# Altium schematic sheet Status_LEDs.SchDoc
size B; SheetNumber: 10; SheetTotal: 12
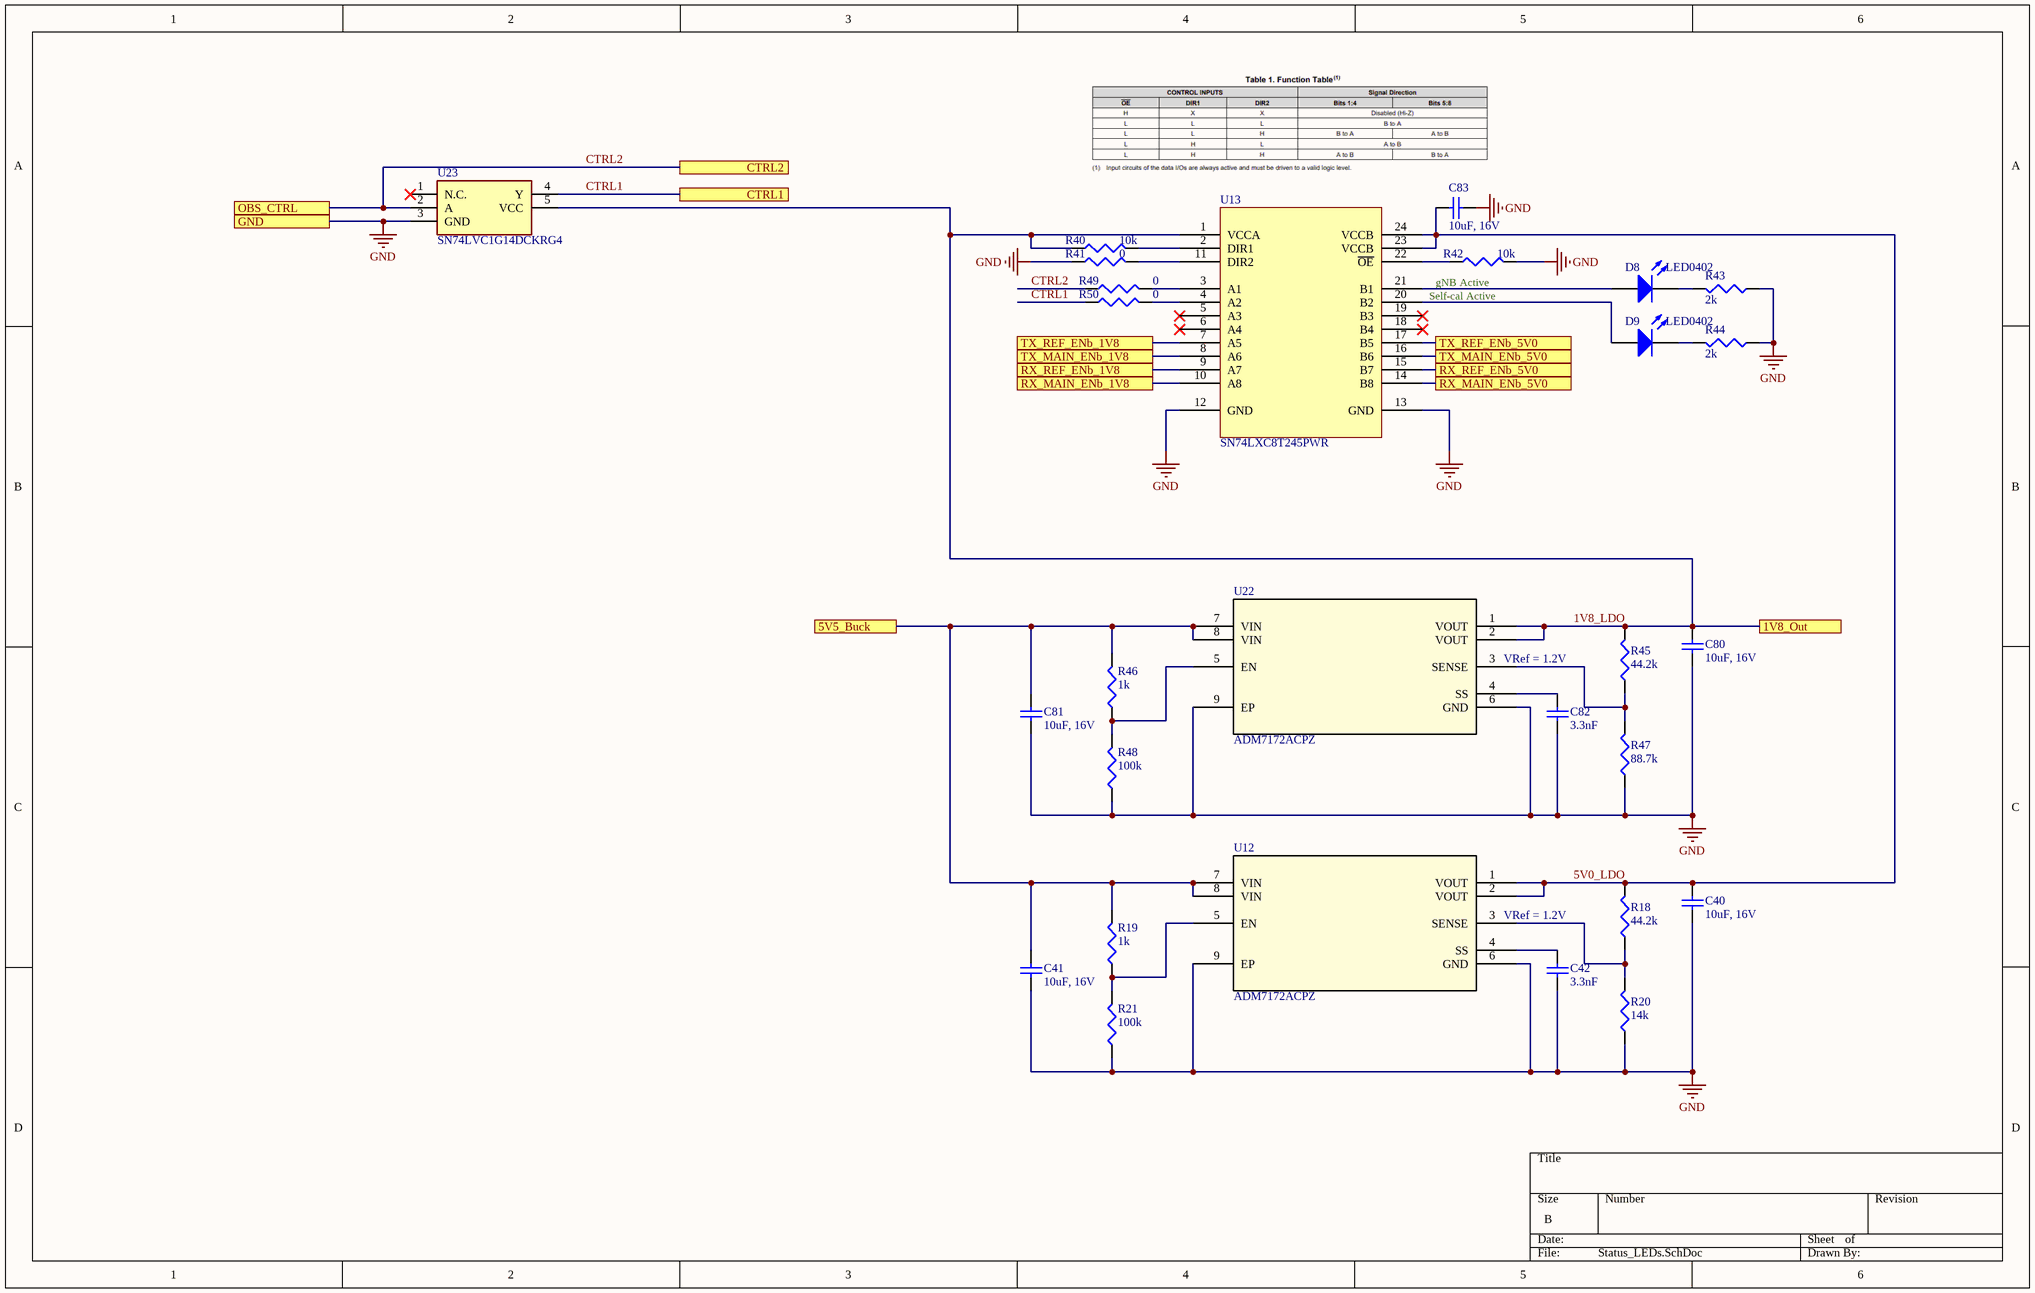
[diagram p0: Status_LEDs.SchDoc]

## Parts
C40  10uF, 16V  [SMD-0603]
C41  10uF, 16V  [SMD-0603]
C42  3.3nF  [Johanson-0201]
C80  10uF, 16V  [SMD-0603]
C81  10uF, 16V  [SMD-0603]
C82  3.3nF  [Johanson-0201]
C83  10uF, 16V  [SMD-0603]
D8  LED0402  [LED-0402]
D9  LED0402  [LED-0402]
R18  44.2k  [SMD-0402]
R19  1k  [SMD-0402]
R20  14k  [SMD-0402]
R21  100k  [SMD-0402]
R40  10k  [SMD-0402]
R41  0  [SMD-0402]
R42  10k  [SMD-0402]
R43  2k  [SMD-0402]
R44  2k  [SMD-0402]
R45  44.2k  [SMD-0402]
R46  1k  [SMD-0402]
R47  88.7k  [SMD-0402]
R48  100k  [SMD-0402]
R49  0  [SMD-0402]
R50  0  [SMD-0402]
U12  ADM7172ACPZ  [ADM7172_VIA_NOSILK]
U13  SN74LXC8T245PWR  [SN74AXC8T245PWR]
U22  ADM7172ACPZ  [ADM7172_VIA_NOSILK]
U23  SN74LVC1G14DCKRG4  [SN74LVC1G14DCKRG4]

## Ports
1V8_Out, 5V5_Buck, CTRL1, CTRL2, GND, OBS_CTRL, RX_MAIN_ENb_1V8, RX_MAIN_ENb_5V0, RX_REF_ENb_1V8, RX_REF_ENb_5V0, TX_MAIN_ENb_1V8, TX_MAIN_ENb_5V0, TX_REF_ENb_1V8, TX_REF_ENb_5V0

## Nets
GND: C40.1 C41.1 C42.1 C80.1 C81.1 C82.1 C83.1 R20.1 R21.1 R41.1 R42.2 R43.1 R44.1 R47.1 R48.1 U12.6(GND) U12.9(EP) U13.12(GND) U13.13(GND) U22.6(GND) U22.9(EP) U23.3(GND) ; port GND
1V8_LDO: C80.2 R40.1 R45.2 U13.1(VCCA) U22.1(VOUT) U22.2(VOUT) U23.5(VCC) ; port 1V8_Out
5V0_LDO: C40.2 C83.2 R18.2 U12.1(VOUT) U12.2(VOUT) U13.23(VCCB) U13.24(VCCB)
5V5_Buck: C41.2 C81.2 R19.2 R46.2 U12.7(VIN) U12.8(VIN) U22.7(VIN) U22.8(VIN) ; port 5V5_Buck
CTRL1: R50.1 U23.4(Y) ; port CTRL1
CTRL2: R49.1 U23.2(A) ; port OBS_CTRL, port CTRL2
RX_MAIN_ENb_1V8: U13.10(A8) ; port RX_MAIN_ENb_1V8
RX_MAIN_ENb_5V0: U13.14(B8) ; port RX_MAIN_ENb_5V0
RX_REF_ENb_1V8: U13.9(A7) ; port RX_REF_ENb_1V8
RX_REF_ENb_5V0: U13.15(B7) ; port RX_REF_ENb_5V0
TX_MAIN_ENb_1V8: U13.8(A6) ; port TX_MAIN_ENb_1V8
TX_MAIN_ENb_5V0: U13.16(B6) ; port TX_MAIN_ENb_5V0
TX_REF_ENb_1V8: U13.7(A5) ; port TX_REF_ENb_1V8
TX_REF_ENb_5V0: U13.17(B5) ; port TX_REF_ENb_5V0
NetC42_2: C42.2 U12.4(SS)
NetC82_2: C82.2 U22.4(SS)
NetD8_1: D8.1(K) R43.2
NetD8_2: D8.2(A) U13.21(B1)
NetD9_1: D9.1(K) R44.2
NetD9_2: D9.2(A) U13.20(B2)
NetR18_1: R18.1 R20.2 U12.3(SENSE)
NetR19_1: R19.1 R21.2 U12.5(EN)
NetR40_2: R40.2 U13.2(DIR1)
NetR41_2: R41.2 U13.11(DIR2)
NetR42_1: R42.1 U13.22(~{OE})
NetR45_1: R45.1 R47.2 U22.3(SENSE)
NetR46_1: R46.1 R48.2 U22.5(EN)
NetR49_2: R49.2 U13.3(A1)
NetR50_2: R50.2 U13.4(A2)

Not connected (* = marked no-connect by the designer): U13 5(A3)* 6(A4)* 18(B4)* 19(B3)*; U23 1(N.C.)*

## Notes on the sheet
- (near R42) gNB Active
- Self-cal Active
- VRef = 1.2V

## Library data of the parts
C40 C41 C80 C81 C83 = CAP0603: Ceramic Capacitor 0603
C42 C82 = CAP0201: Capacitor 0201 Imperial
D8 D9 = LED0402: LED 0402
R18-R21 R40-R50 = RES0402: Resistor-0402
U12 U22 = ADM7172ACPZ: 6.5V, 2A, Ultralow Noise, High PSRR, Fast Transient Response CMOS LDO; Value: Value; Type: Type; RefDes: RefDes
U13 = SN74AXC8T245PWR: SN74LXC8T245 8-Bit Dual-Supply Bus Transceiver With Configurable Voltage Translation / and Tri-State Outputs
U23 = SN74LVC1G14DCKRG4: Single Schmitt-Trigger Inverter; Manufacturer_Name: Texas Instruments; Geometry.Height: 1.1mm; Manufacturer_Part_Number: SN74LVC1G14DCKRG4; Mouser Part Number: 595-SN74LVC1G14DCKG4; Mouser Price/Stock: https://www.mouser.co.uk/ProductDetail/Texas-Instruments/SN74LVC1G14DCKRG4?qs=pajgIaoyDUh5K3ZGC7gUbg%3D%3D; Arrow Part Number: SN74LVC1G14DCKRG4; Arrow Price/Stock: https://www.arrow.com/en/products/sn74lvc1g14dckrg4/texas-instruments?utm_currency=USD&region=nac; Datasheet Link: http://www.ti.com/lit/gpn/SN74LVC1G14